# EAGLE design DRV8302 Breakout (EAGLE 7.7.0)
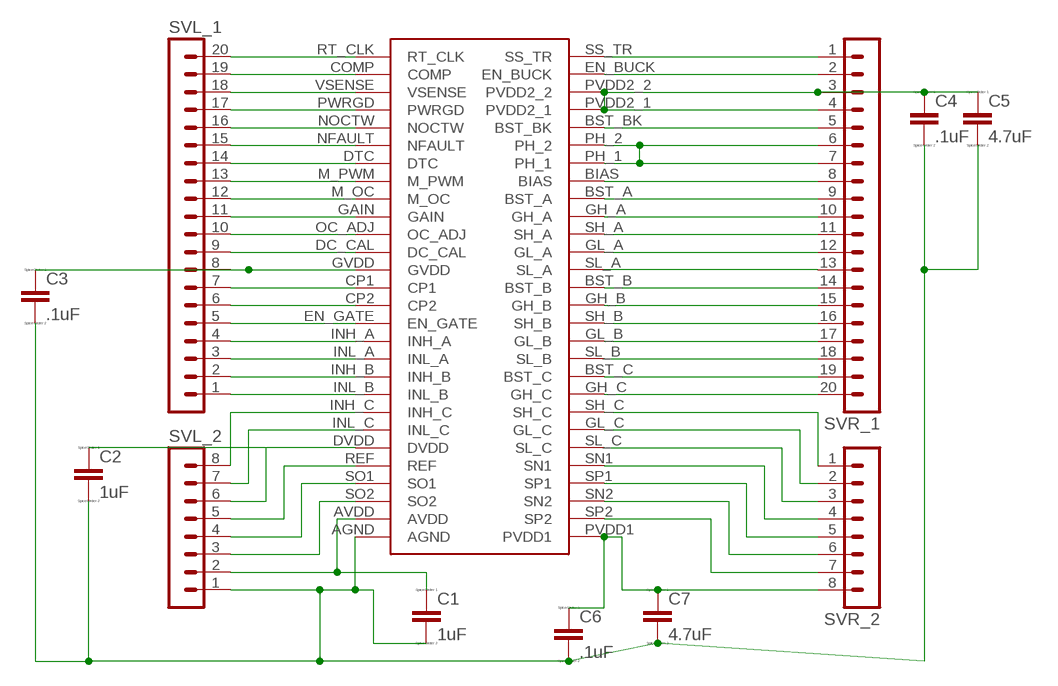
[diagram p0: schematic, sheet 1]

## Parts
C1  1uF  CC0603  [C0603]
C2  1uF  CC0603  [C0603]
C3  .1uF  CC0603  [C0603]
C4  .1uF  CC0603  [C0603]
C5  4.7uF  CC0603  [C0603]
C6  .1uF  CC0603  [C0603]
C7  4.7uF  CC0603  [C0603]
IC1  DRV8302DRV8302  [DRV8302]
SVL_1  MA20-1  [MA20-1]
SVL_2  MA08-1  [MA08-1]
SVR_1  MA20-1  [MA20-1]
SVR_2  MA08-1  [MA08-1]

## Nets
AVDD: C1.1 IC1.AVDD SVL_2.2
BIAS: IC1.BIAS SVR_1.8
BST_A: IC1.BST_A SVR_1.9
BST_BK: IC1.BST_BK SVR_1.5
BST_C: IC1.BST_C SVR_1.19
COMP: IC1.COMP SVL_1.19
CP1: IC1.CP1 SVL_1.7
CP2: IC1.CP2 SVL_1.6
DC_CAL: IC1.DC_CAL SVL_1.9
DTC: IC1.DTC SVL_1.14
DVDD: C2.1 IC1.DVDD SVL_2.6
EN_BUCK: IC1.EN_BUCK SVR_1.2
EN_GATE: IC1.EN_GATE SVL_1.5
GAIN: IC1.GAIN SVL_1.11
GH_A: IC1.GH_A SVR_1.10
GH_B: IC1.GH_B SVR_1.15
GH_C: IC1.GH_C SVR_1.20
GL_A: IC1.GL_A SVR_1.12
GL_B: IC1.GL_B SVR_1.17
GL_C: IC1.GL_C SVR_2.2
GND: C1.2 C2.2 C3.2 C4.2 C5.2 C6.2 C7.2 IC1.AGND SVL_2.1
GVDD: C3.1 IC1.GVDD SVL_1.8
INH_A: IC1.INH_A SVL_1.4
INH_B: IC1.INH_B SVL_1.2
INH_C: IC1.INH_C SVL_2.8
INL_A: IC1.INL_A SVL_1.3
INL_B: IC1.INL_B SVL_1.1
INL_C: IC1.INL_C SVL_2.7
M_OC: IC1.M_OC SVL_1.12
M_PWM: IC1.M_PWM SVL_1.13
N$1: IC1.SL_A SVR_1.13
N$2: IC1.BST_B SVR_1.14
NFAULT: IC1.NFAULT SVL_1.15
NOCTW: IC1.NOCTW SVL_1.16
OC_ADJ: IC1.OC_ADJ SVL_1.10
PH_1: IC1.PH_1 IC1.PH_2 SVR_1.6 SVR_1.7
PVDD1: C6.1 C7.1 IC1.PVDD1 SVR_2.8
PVDD2_1: C4.1 C5.1 IC1.PVDD2_1 IC1.PVDD2_2 SVR_1.3 SVR_1.4
PWRGD: IC1.PWRGD SVL_1.17
REF: IC1.REF SVL_2.5
RT_CLK: IC1.RT_CLK SVL_1.20
SH_A: IC1.SH_A SVR_1.11
SH_B: IC1.SH_B SVR_1.16
SH_C: IC1.SH_C SVR_2.1
SL_B: IC1.SL_B SVR_1.18
SL_C: IC1.SL_C SVR_2.3
SN1: IC1.SN1 SVR_2.4
SN2: IC1.SN2 SVR_2.6
SO1: IC1.SO1 SVL_2.4
SO2: IC1.SO2 SVL_2.3
SP1: IC1.SP1 SVR_2.5
SP2: IC1.SP2 SVR_2.7
SS_TR: IC1.SS_TR SVR_1.1
VSENSE: IC1.VSENSE SVL_1.18

## Library data of the parts
C1-C7 = eagle-ltspice:C: CAPACITOR, European symbol; SPICEMODEL: NONE; SPICEPREFIX: C
IC1 = DRV_8302:DRV8302
SVL_1 SVR_1 = con-lstb:MA20-1: PIN HEADER; OC_FARNELL: unknown; OC_NEWARK: unknown
SVL_2 SVR_2 = con-lstb:MA08-1: PIN HEADER; OC_FARNELL: unknown; OC_NEWARK: unknown

## Net classes
0 default: drill 0.6 mm

## Board
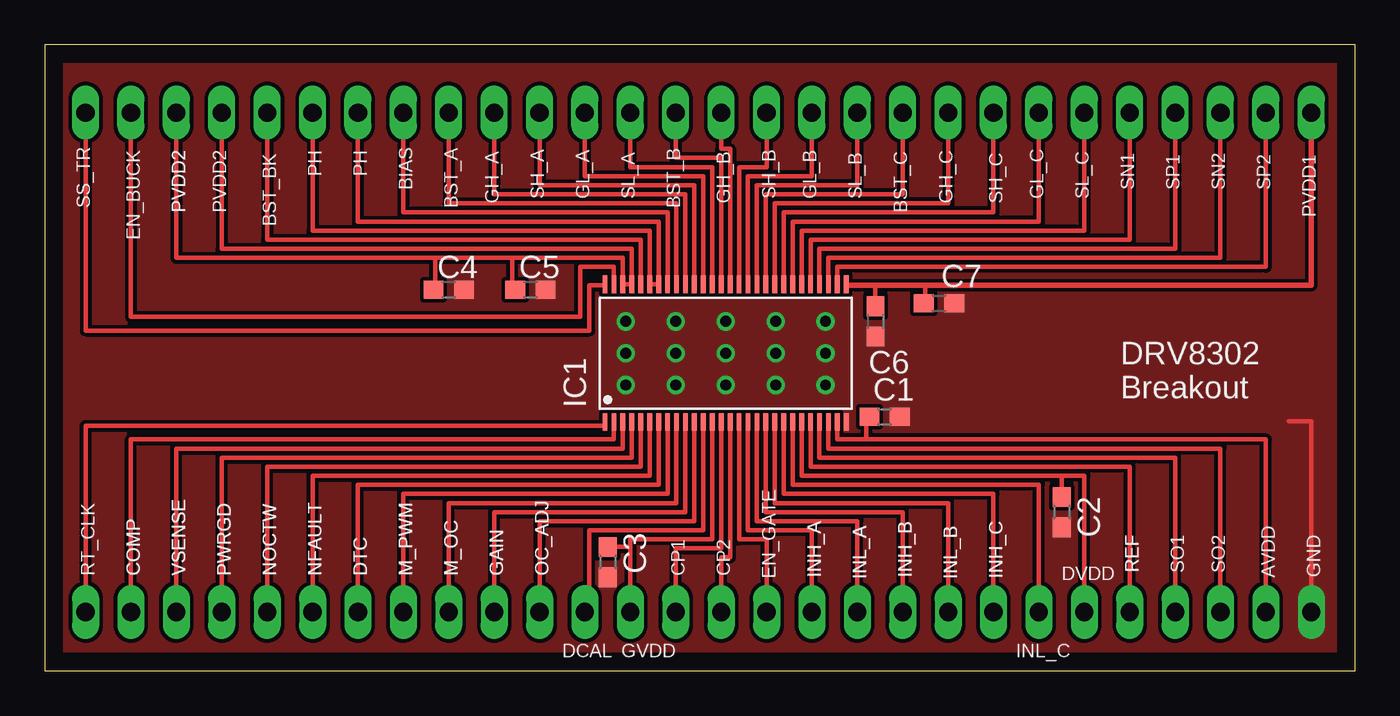
[diagram p1: board, top side]
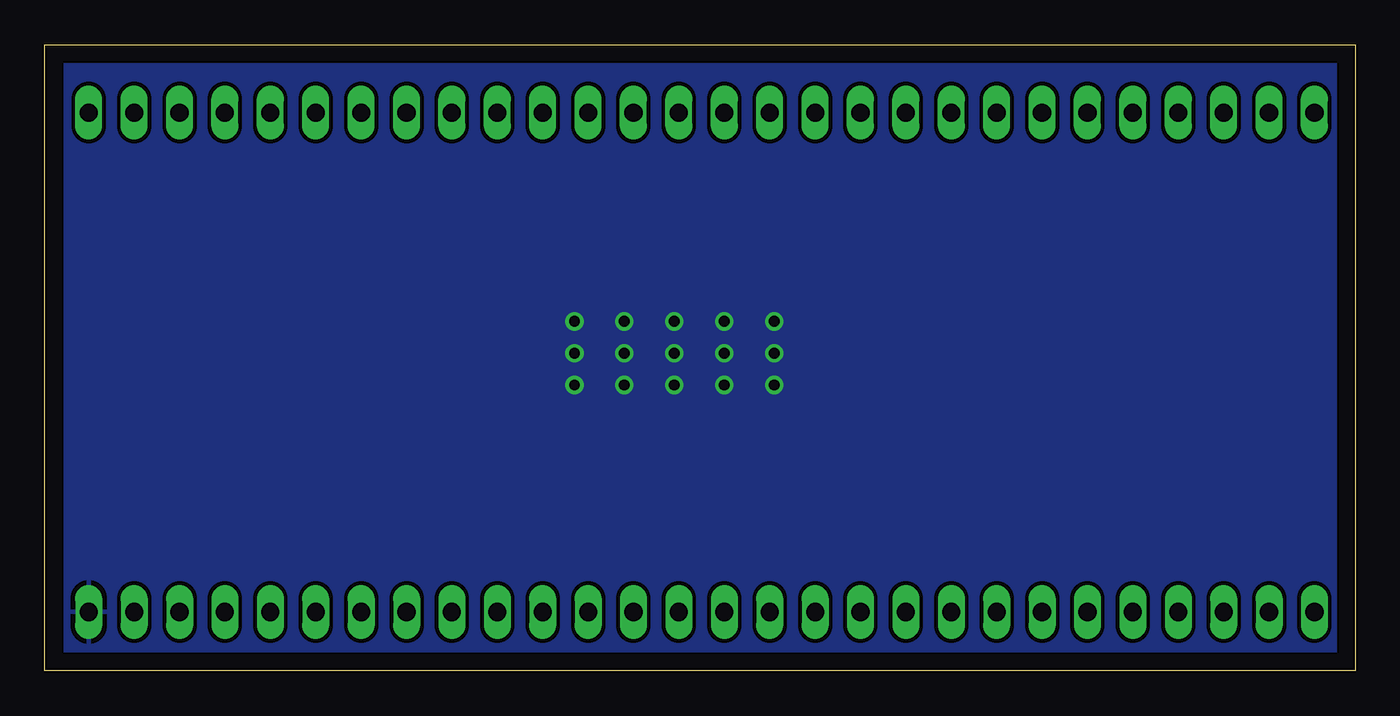
[diagram p2: board, bottom side, seen from below]

Size 73.33 x 35.04 mm. Coordinates in mm from the lower left corner, seen from the top.
Outline: 0,0 73.33,0 73.33,35.04 0,35.04 0,0
Copper layers (1*16): Top 0.035mm / dielectric 1.5mm / Bottom 0.035mm
Design rules "default": minimum track width 10mil, minimum drill 24mil, track to track 8mil, track to pad 8mil, pad to pad 8mil, via to via 8mil, smd to smd 8mil, copper to edge 40mil, drill to drill 8mil, minimum pad ring 10mil, minimum via ring 8mil, stop-mask expansion 4mil, vias tented up to drill 0mil, thermal gap 10mil

### Footprints (pad centres in the part's own frame; a part is rotated, then mirrored left to right if it is on the bottom)
C0603 = smd 1.1 x 1: 1 -0.85,0; 2 0.85,0
DRV8302 = smd 0.27 x 1: AGND 6.75,-3.85; AVDD 6.25,-3.85; BIAS -3.25,3.85; BST_A -2.75,3.85; BST_B -0.25,3.85; BST_BK -4.75,3.85; BST_C 2.25,3.85; COMP -6.25,-3.85; CP1 -0.25,-3.85; CP2 0.25,-3.85; DC_CAL -1.25,-3.85; DTC -3.75,-3.85; DVDD 4.25,-3.85; EN_BUCK -6.25,3.85; EN_GATE 0.75,-3.85; GAIN -2.25,-3.85; GH_A -2.25,3.85; GH_B 0.25,3.85; GH_C 2.75,3.85; GL_A -1.25,3.85; GL_B 1.25,3.85; GL_C 3.75,3.85; GVDD -0.75,-3.85; INH_A 1.25,-3.85; INH_B 2.25,-3.85; INH_C 3.25,-3.85; INL_A 1.75,-3.85; INL_B 2.75,-3.85; INL_C 3.75,-3.85; M_OC -2.75,-3.85; M_PWM -3.25,-3.85; NFAULT -4.25,-3.85; NOCTW -4.75,-3.85; OC_ADJ -1.75,-3.85; PH_1 -3.75,3.85; PH_2 -4.25,3.85; PVDD1 6.75,3.85; PVDD2_1 -5.25,3.85; PVDD2_2 -5.75,3.85; PWRGD -5.25,-3.85; REF 4.75,-3.85; RT_CLK -6.75,-3.85; SH_A -1.75,3.85; SH_B 0.75,3.85; SH_C 3.25,3.85; SL_A -0.75,3.85; SL_B 1.75,3.85; SL_C 4.25,3.85; SN1 4.75,3.85; SN2 5.75,3.85; SO1 5.25,-3.85; SO2 5.75,-3.85; SP1 5.25,3.85; SP2 6.25,3.85; SS_TR -6.75,3.85; VSENSE -5.75,-3.85
MA20-1 = drill 1.016 long: 1 -24.13,0; 2 -21.59,0; 3 -19.05,0; 4 -16.51,0; 5 -13.97,0; 6 -11.43,0; 7 -8.89,0; 8 -6.35,0; 9 -3.81,0; 10 -1.27,0; 11 1.27,0; 12 3.81,0; 13 6.35,0; 14 8.89,0; 15 11.43,0; 16 13.97,0; 17 16.51,0; 18 19.05,0; 19 21.59,0; 20 24.13,0
MA08-1 = drill 1.016 long: 1 -8.89,0; 2 -6.35,0; 3 -3.81,0; 4 -1.27,0; 5 1.27,0; 6 3.81,0; 7 6.35,0; 8 8.89,0

### Placement (x,y rotation side)
C1  46.99,14.22 0 top
C2  56.9,8.89 270 top
C3  31.5,6.1 270 top
C4  22.61,21.34 0 top
C5  27.18,21.34 0 top
C6  46.48,19.56 270 top
C7  50.04,20.57 0 top
IC1  38.1,17.78 0 top
SVL_1  26.42,3.3 180 top
SVL_2  61.98,3.3 180 top
SVR_1  26.42,31.24 0 top
SVR_2  61.98,31.24 0 top

### Tracks (layer width: path | path; a pad name or v marks a point on that pad's centre or on a via)
AVDD
  Top 0.254: SVL_2.2 68.33,12.95 45.97,12.95 | 45.97,12.95 44.35,12.95 IC1.AVDD | C1.1 45.97,14.22 45.97,12.95
BIAS
  Top 0.254: SVR_1.8 20.07,25.65 34.85,25.65 IC1.BIAS
BST_A
  Top 0.254: SVR_1.9 22.61,26.16 35.35,26.16 IC1.BST_A
BST_BK
  Top 0.254: SVR_1.5 12.45,24.13 33.35,24.13 IC1.BST_BK
BST_C
  Top 0.254: SVR_1.19 48.01,26.67 40.35,26.67 IC1.BST_C
COMP
  Top 0.254: SVL_1.19 4.83,12.95 31.85,12.95 IC1.COMP
CP1
  Top 0.254: SVL_1.7 35.31,6.86 37.85,6.86 IC1.CP1
CP2
  Top 0.254: SVL_1.6 37.85,6.35 38.35,6.35 IC1.CP2
DC_CAL
  Top 0.254: SVL_1.9 30.48,3.3 30.48,7.87 36.85,7.87 IC1.DC_CAL
DTC
  Top 0.254: SVL_1.14 17.53,10.41 34.35,10.41 IC1.DTC
DVDD
  Top 0.254: SVL_2.6 58.17,10.92 56.9,10.92 | 56.9,10.92 42.35,10.92 IC1.DVDD | C2.1 56.9,10.92
EN_BUCK
  Top 0.254: SVR_1.2 4.83,19.81 29.97,19.81 29.97,22.61 31.85,22.61 IC1.EN_BUCK
EN_GATE
  Top 0.254: SVL_1.5 40.39,7.37 38.85,7.37 IC1.EN_GATE
GAIN
  Top 0.254: SVL_1.11 25.15,8.89 35.85,8.89 IC1.GAIN
GH_A
  Top 0.254: SVR_1.10 25.15,26.67 35.85,26.67 IC1.GH_A
GH_B
  Top 0.254: SVR_1.15 37.85,29.21 38.35,29.21 IC1.GH_B
GH_C
  Top 0.254: SVR_1.20 50.55,26.16 40.85,26.16 IC1.GH_C
GL_A
  Top 0.254: SVR_1.12 30.23,27.69 36.85,27.69 IC1.GL_A
GL_B
  Top 0.254: SVR_1.17 42.93,27.69 39.35,27.69 IC1.GL_B
GL_C
  Top 0.254: SVR_2.2 55.63,25.15 41.85,25.15 IC1.GL_C
GND  (via drill 0.61)
  Top 0.254: SVL_2.1 70.87,13.97 69.6,13.97 | 44.85,13.97 IC1.AGND
  other vias: 43.69,19.56 43.69,17.78 43.69,16 40.89,16 40.89,17.78 40.89,19.56 38.1,19.56 38.1,17.78 38.1,16 32.51,16 32.51,17.78 35.31,19.56 35.31,17.78 35.31,16 32.51,19.56
  pour Bottom: 0.51,34.54 72.64,34.29 72.64,0.51 0.51,0.51
  pour Top (no thermals): 0.51,34.54 72.64,34.29 72.64,0.51 0.51,0.51
GVDD
  Top 0.254: IC1.GVDD 37.34,7.37 32.77,7.37 32.77,6.95 | 32.77,6.95 SVL_1.8 | C3.1 32.77,6.95
INH_A
  Top 0.254: SVL_1.4 42.93,7.87 39.35,7.87 IC1.INH_A
INH_B
  Top 0.254: SVL_1.2 48.01,8.89 40.35,8.89 IC1.INH_B
INH_C
  Top 0.254: SVL_2.8 53.09,9.91 41.35,9.91 IC1.INH_C
INL_A
  Top 0.254: SVL_1.3 45.47,8.38 39.85,8.38 IC1.INL_A
INL_B
  Top 0.254: SVL_1.1 50.55,9.4 40.85,9.4 IC1.INL_B
INL_C
  Top 0.254: SVL_2.7 55.63,10.41 41.85,10.41 IC1.INL_C
M_OC
  Top 0.254: SVL_1.12 22.61,9.4 35.35,9.4 IC1.M_OC
M_PWM
  Top 0.254: SVL_1.13 20.07,9.91 34.85,9.91 IC1.M_PWM
N$1
  Top 0.254: SVR_1.13 32.77,28.19 37.35,28.19 IC1.SL_A
N$2
  Top 0.254: SVR_1.14 35.31,28.7 37.85,28.7 IC1.BST_B
NFAULT
  Top 0.254: SVL_1.15 14.99,10.92 33.85,10.92 IC1.NFAULT
NOCTW
  Top 0.254: SVL_1.16 12.45,11.43 33.35,11.43 IC1.NOCTW
OC_ADJ
  Top 0.254: SVL_1.10 27.69,8.38 36.35,8.38 IC1.OC_ADJ
PH_1
  Top 0.254: SVR_1.7 17.53,25.15 34.35,25.15 IC1.PH_1 IC1.PH_2 33.85,24.64 14.99,24.64 SVR_1.6
PVDD1
  Top 0.254: 44.85,21.59 IC1.PVDD1 | C6.1 46.48,21.59 | C7.1 49.28,20.57 49.28,21.59
  Top 0.305: SVR_2.8 70.87,21.59 49.28,21.59 46.48,21.59 44.85,21.59
PVDD2_1
  Top 0.254: SVR_1.3 7.37,23.11 21.84,23.11 | 21.84,23.11 26.16,23.11 | 26.16,23.11 32.35,23.11 IC1.PVDD2_2 IC1.PVDD2_1 32.85,23.62 9.91,23.62 SVR_1.4 | C4.1 21.84,21.34 21.84,23.11 | C5.1 26.16,21.34 26.16,23.11
PWRGD
  Top 0.254: SVL_1.17 9.91,11.94 32.85,11.94 IC1.PWRGD
REF
  Top 0.254: SVL_2.5 60.71,11.43 42.85,11.43 IC1.REF
RT_CLK
  Top 0.254: SVL_1.20 2.29,13.72 31.35,13.72 IC1.RT_CLK
SH_A
  Top 0.254: SVR_1.11 27.69,27.18 36.35,27.18 IC1.SH_A
SH_B
  Top 0.254: SVR_1.16 40.39,28.19 38.85,28.19 IC1.SH_B
SH_C
  Top 0.254: SVR_2.1 53.09,25.65 41.35,25.65 IC1.SH_C
SL_B
  Top 0.254: SVR_1.18 45.47,27.18 39.85,27.18 IC1.SL_B
SL_C
  Top 0.254: SVR_2.3 58.17,24.64 42.35,24.64 IC1.SL_C
SN1
  Top 0.254: SVR_2.4 60.71,24.13 42.85,24.13 IC1.SN1
SN2
  Top 0.254: SVR_2.6 65.79,23.11 43.85,23.11 IC1.SN2
SO1
  Top 0.254: SVL_2.4 63.25,11.94 43.35,11.94 IC1.SO1
SO2
  Top 0.254: SVL_2.3 65.79,12.45 43.85,12.45 IC1.SO2
SP1
  Top 0.254: SVR_2.5 63.25,23.62 43.35,23.62 IC1.SP1
SP2
  Top 0.254: SVR_2.7 68.33,22.61 44.35,22.61 IC1.SP2
SS_TR
  Top 0.254: SVR_1.1 2.29,19.05 30.48,19.05 30.48,21.59 31.35,21.59 IC1.SS_TR
VSENSE
  Top 0.254: SVL_1.18 7.37,12.45 32.35,12.45 IC1.VSENSE

### Text on the board
tPlace: PH | PH | BIAS | SH_A | GL_A | SL_A | SH_B | GL_B | SL_B | GL_C | SL_C | SN1 | SP1 | SN2 | SP2 | SS_TR | PVDD2 | PVDD2 | PVDD2 | BST_A | GH_A | BST_B | GH_B | BST_C | GH_C | SH_C | PVDD1 | BST_BK | EN_BUCK | DRV8302 / Breakout | EN_GATE | INH_A | INH_A | INH_B | INH_B | INH_C | INH_C | CP1 | CP2 | INL_A | INL_A | INL_B | INL_B | REF | REF | SO1 | SO2 | AVDD | GND | RT_CLK | COMP | COMP | VSENSE | VSENSE | PWRGD | PWRGD | NOCTW | NOCTW | NFAULT | NFAULT | DTC | DTC | M_PWM | M_PWM | M_OC | M_OC | GAIN | GAIN | OC_ADJ | OC_ADJ | DVDD | DCAL | GVDD | INL_C